# Altium schematic sheet AudioStage.SchDoc: Audio stage
size A4; Revision: 1.0; SheetNumber: 5; SheetTotal: 5; Alumno: Trotta, Ignacio; Curso: R1001; Materia: Sistemas de Representación; Docentes: JM Perdomo, E Ipar
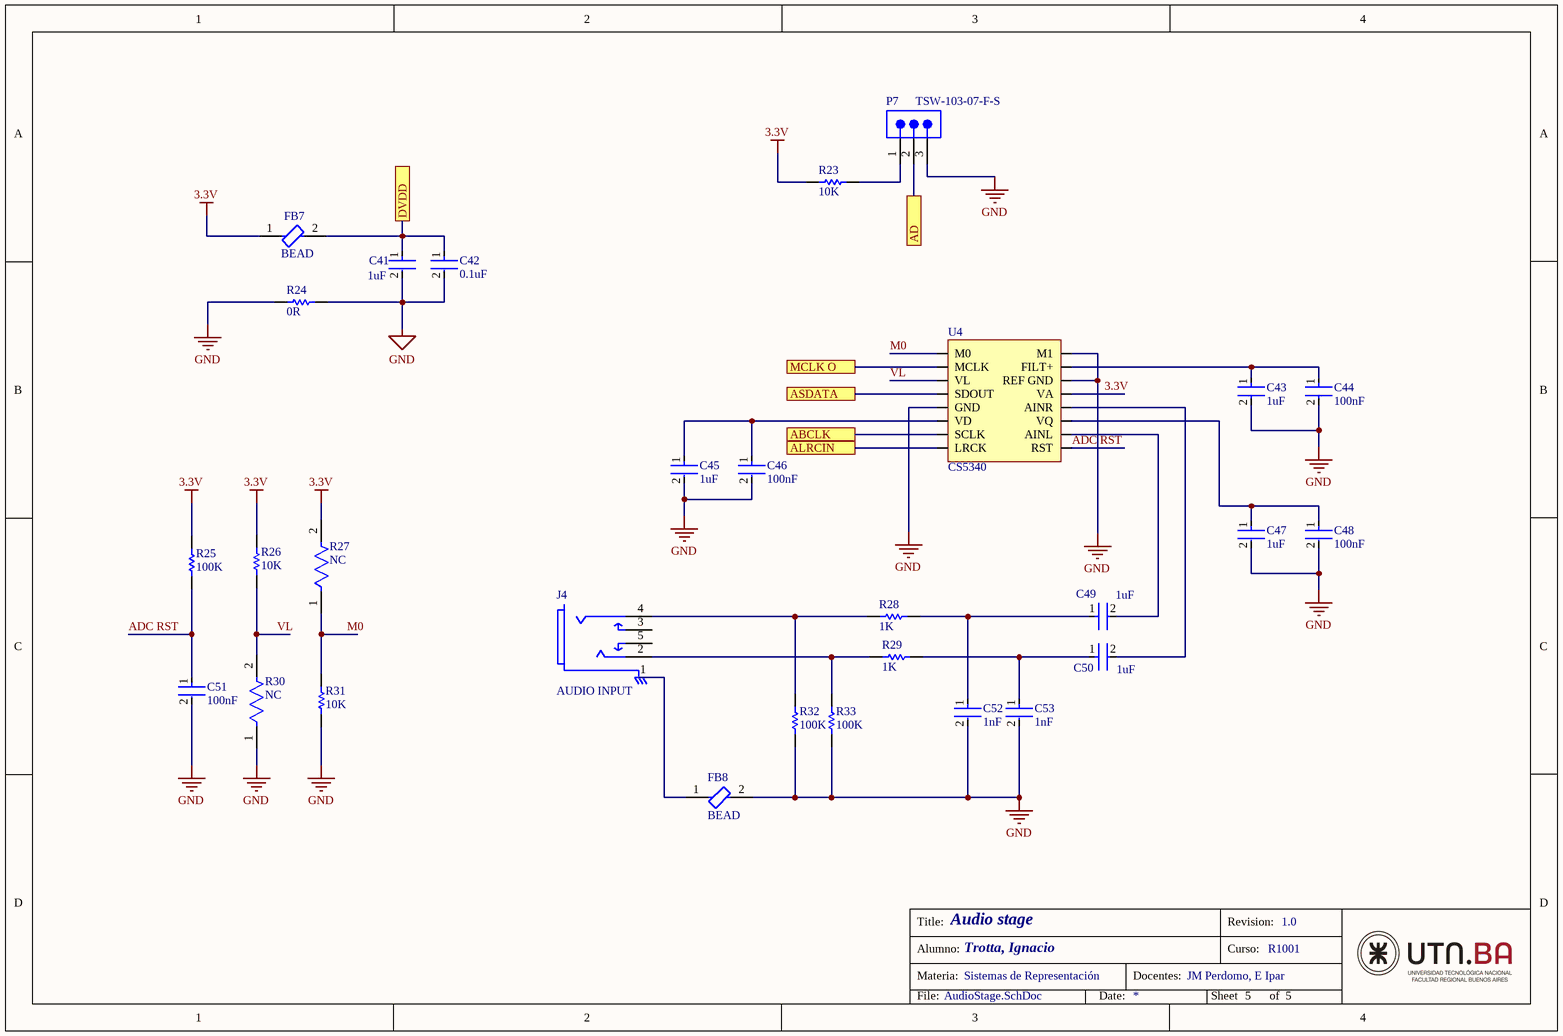
[diagram p0: AudioStage.SchDoc]

## Parts
C41  1uF  [FP-CC0603-DA-MFG]
C42  0.1uF  [FP-CC0603-DA-MFG]
C43  1uF  [FP-CC0603-DA-MFG]
C44  100nF  [FP-CC0603-DA-MFG]
C45  1uF  [FP-CC0603-DA-MFG]
C46  100nF  [FP-CC0603-DA-MFG]
C47  1uF  [FP-CC0603-DA-MFG]
C48  100nF  [FP-CC0603-DA-MFG]
C49  1uF  [FP-CC0603-DA-MFG]
C50  1uF  [FP-CC0603-DA-MFG]
C51  100nF  [FP-CC0603-DA-MFG]
C52  1nF  [FP-CC0603-DA-MFG]
C53  1nF  [FP-CC0603-DA-MFG]
FB7  BEAD  [FP-BLM18-0_15-t0_8-IPC_B]
FB8  BEAD  [FP-BLM18-0_15-t0_8-IPC_B]
J4  AUDIO INPUT  [FP-35RAPC4BV4-MFG]
P7  TSW-103-07-F-S  [SMTC-TSW-103-07-X-S]
R23  10K  [RESC1608X55X25ML10T15]
R24  0R  [RESC1608X55X25ML10T15]
R25  100K  [RESC1608X55X25ML10T15]
R26  10K  [RESC1608X55X25ML10T15]
R27  NC  [FP-CR0805-MFG]
R28  1K  [RESC1608X55X25ML10T15]
R29  1K  [RESC1608X55X25ML10T15]
R30  NC  [FP-CR0805-MFG]
R31  10K  [RESC1608X55X25ML10T15]
R32  100K  [RESC1608X55X25ML10T15]
R33  100K  [RESC1608X55X25ML10T15]
U4  CS5340  [TSSOP-16L]

## Ports
ABCLK, AD, ALRCIN, ASDATA, DVDD, MCLK O

## Nets
3.3V: FB7.1 R23.1 R25.2 R26.2 R27.2 U4.13(VA)
GND: C41.2 C42.2 C43.2 C44.2 C45.2 C46.2 C47.2 C48.2 C51.2 C52.2 C53.2 FB8.2 P7.3 R24.1 R24.2 R30.1 R31.1 R32.1 R33.1 U4.5(GND) U4.14(REF_GND) U4.16(M1)
ABCLK: U4.7(SCLK) ; port ABCLK
AD: P7.2 ; port AD
ADC RST: C51.1 R25.1 U4.9(RST)
ALRCIN: U4.8(LRCK) ; port ALRCIN
ASDATA: U4.4(SDOUT) ; port ASDATA
DVDD: C41.1 C42.1 FB7.2 ; port DVDD
M0: R27.1 R31.2 U4.1(M0)
MCLK O: U4.2(MCLK) ; port MCLK O
VL: R26.1 R30.2 U4.3(VL)
NetC43_1: C43.1 C44.1 U4.15(FILT+)
NetC45_1: C45.1 C46.1 U4.6(VD)
NetC47_1: C47.1 C48.1 U4.11(VQ)
NetC49_1: C49.1 C52.1 R28.2
NetC49_2: C49.2 U4.10(AINL)
NetC50_1: C50.1 C53.1 R29.2
NetC50_2: C50.2 U4.12(AINR)
NetFB8_1: FB8.1 J4.1
NetJ4_2: J4.2 R29.1 R33.2
NetJ4_4: J4.4 R28.1 R32.2
NetP7_1: P7.1 R23.2

Not connected (* = marked no-connect by the designer): J4 3 5

## Notes on the sheet
- Title:
- Revision:
- Alumno:
- Materia:
- Docentes:
- Curso:
- File:
- Date:
- Sheet
- of

## Library data of the parts
C41-C53 = CMP-2100-03600-2: CAP CER 10000PF 50V X7R 0603; Manufacturer Part Number: CC0603KRX7R9BB103; Manufacturer: YAGEO; Tolerance: 0.1; Material: Ceramic; Temperature Coefficient: 15%; Value: 10 nF; Mouser Description: Multilayer Ceramic Capacitor, CC Series, 0.01 - F, - 10%, X7R, 50 V, 0603 [1608 Metric]; Digikey Description: CAP CER 10000PF 50V X7R 0603; Height: 0.9mm; Category: Cap; Temperature Characteristic: X7R; Footprint Url: http://www.yageo.com/exep/pages/download/literatures/UPY-C_GEN_24.pdf; Lead Free: Yes; Voltage Rating: 50 V; Temperature: -55°C to +125°C; Device Class L3: Ceramic Capacitors; ComponentLink2Description: Datasheet; Voltage: 50 V; Package: CC0603-DA; Octopart: https://octopart.com/cc0603krx7r9bb103-yageo-192938; Automotive: No; Temperature Range High: +125°C; Temperature Range Low: -55°C; RoHS: TRUE; Device Class L1: Passive Components; ComponentLink2URL: http://www.yageo.com/documents/recent/UPY-GPHC_X7R_6.3V-to-50V_18.pdf; Device Class L2: Capacitors; Capacitance: 10 nF
FB7 FB8 = CMP-0686-00503-3: Chip Ferrite Bead, 0603, 75Ω @ 100MHz, 0.3Ω, 25%, 600mA; Resistance: 350mR; Max DC Current: 500mA; Shielding: Unshielded; Number of Lines: 1; Impedance: 75R; Conductor Material: Copper; Material: Steel; DC Resistance (DCR): 300mR; Temperature Coefficient: 10ppm/°C; Max Current Rating: 500mA; Case/Package: 0603; Case Code (Imperial): 0603; DC Current: 500mA; Test Frequency: 100MHz; Military Standard: Not; Series: BLM18B; Min Operating Temperature: -55°C; Number of Pins: 2; Termination: SMD/SMT; Length: 1.6mm; Packaging: Tape and Reel; Max Operating Temperature: 125°C; Package Quantity: 1; REACH SVHC: No SVHC; Height: 0.8mm; Radiation Hardening: No; Depth: 0.8mm; Tolerance: 25%; Current Rating: 500mA; Width: 0.8mm; Core Material: Ferrite; RoHS Compliant: Yes; DC Resistance-Max: 300mR; Lead Free: Lead Free; Case Code (Metric): 1608; Number of Circuits: 1
J4 = CMP-47983-000001-1: CONN JACK STEREO 3.5MM R/A; Manufacturer: Switchcraft; Obsolete Part: true; Manufacturer Part Number: 35RAPC4BV4; Conn Orientation: Right Angle; Number Of Contacts: 5; Contact Material: Silver; Device Class L1: Connectors; Height: 0.495inch; ComponentLink2URL: http://www.switchcraft.com/Drawings/35rapc__v4_cd.pdf; Category: Conn; Digikey Description: CONN JACK STEREO 3.5MM R/A; Automotive: No; ComponentLink2Description: Datasheet; Package: 35RAPC4BV4; Device Class L2: Audio / Video Connectors; Mouser Description: Phone Connectors 3.5MM VERT STEREO JK; RoHS: TRUE; Octopart: https://octopart.com/35rapc4bv4-switchcraft-223606; Lead Free: Yes; Device Class L3: unset
P7 = CMP-1024-00331-1: 0.025" SQ Post Header, Through-hole, Vertical, -55 to 125 degC, 2.54 mm Pitch, 3-Pin, Male, RoHS; Manufacturer: Samtec; Pitch: 2.54 mm; DatasheetVersion: F-214; ComponentLink1Description: Manufacturer URL; ComponentLink3URL: http://www.samtec.com/documents/webfiles/cpdf/TSW-XXX-XX-XXX-X-XX-XXX-MKT.pdf; Mounting Technology: Through-hole; PackageDescription: .025[0.64] SQ. Post Terminal Strip Assembly; Temperature Range: -55 to 125 degC; ComponentLink3Description: Package Specification; Orientation: Vertical; PartNumber: TSW-103-07-F-S; RoHS: True; PackageVersion: DM, 8/1988; ComponentLink2Description: Datasheet; ComponentLink1URL: http://www.samtec.com; ComponentLink2URL: http://www.samtec.com/documents/webfiles/pdf/TSW_TH.PDF; PackageReference: TSW-103-07-X-S
R23-R26 R31-R33 = CMP-2000-05021-1: Chip Resistor, 100 Ohm, +/- 5%, 50 V, 0603 (1608 Metric), RoHS, Tape and Reel; Manufacturer: Yageo; Temperature Coefficient: 100PPM/C; Resistance: 100Ohms; Power Rating: 100mW; Voltage Rating: 50V; Manufacturer URL: http://www.yageo.com/; Product: ThickFilmResistorsGeneralPurpose; Package Description: 2-Pin Surface Mount Device, Body 1.6 x 0.8 mm; Tolerance: 5%; Termination Style: SMD/SMT; Datasheet URL: http://www.farnell.com/datasheets/443971.pdf; Operating Temperature Range: -55Cto+155C; Packaging: Reel; Case Code - in: 0603; Package Reference: 603; Series: RC; Case Code - mm: 1608; Datasheet Version: Rev. 4, 04/2009
R27 R30 = CMP-07231-001707-1: Thick Film Chip Resistors 0805 100kΩ 0.125W 5% 200ppm/°C; Power Rating: 125mW; Voltage Rating: 150V; Resistance: 100kR; Case Code (Metric): 2012; Case Code (Imperial): 0805; Temperature Coefficient: 200ppm/°C; Mount: Surface Mount; Tolerance: 5%; Radiation Hardening: No; Military Standard: Not; Contact Plating: Tin; Number of Terminations: 2; Packaging: Tape and Reel; Thickness: 508um; Length: 0.079inch; Depth: 1.25mm; Min Operating Temperature: -55°C; Features: Moisture Resistant; Max Operating Temperature: 155°C; Width: 0.049inch; Package Quantity: 10000; Termination: SMD/SMT; Composition: Thick Film; Max Power Dissipation: 125mW; Height: 0.024inch; Case/Package: 0805
R28 R29 = CMP-2100-03667-1: Chip Resistor, 0 Ohm, +/- 5%, 0.1 W, -55 to 155 degC, 0603 (1608 Metric), RoHS, Tape and Reel; Manufacturer: Yageo; Temperature Coefficient: 200ppm/degreesC; Voltage Rating: 50V; Power Rating: 100mW; Resistance: 0mOhm; Width: 0.8mm; Max Operating Temperature: 155degC; Tolerance: 5%; Package Reference: 0603; Height: 0.45mm; Depth: 0.8mm; Package Description: 2-Pin Surface Mount Device, Body 1.6 x 0.8 mm; Termination: SMD/SMT; Package Quantity: 5000; Case/Package: 0603; Case Code (Imperial): 0603; Radiation Hardening: No; Number of Pins: 2; Length: 1.6mm; Lead Free: LeadFree; Voltage Rating (DC): 50V; Military Standard: Not; Datasheet URL: http://www.yageo.com/NewPortal/yageodocoutput?fileName=/pdf/R-Chip/PYu-RC_Group_51_RoHS_L_5.pdf; Manufacturer URL: http://www.yageo.com/; Packaging: TapeandReel; Case Code (Metric): 1608; Min Operating Temperature: -55degC; Composition: ThickFilm; RoHSCompliant: true; Contact Plating: Tin; Datasheet Version: Rev. 5, 10/2016; REACH SVHC: NoSVHC
U4 = CS5340_Trotta: 101dB, 192kHz, Multi-Bit Audio A/D Converter